# EasyEDA Pro project ProPrj_ST-Link_2025-02-09.epro, board ST-LINK_v1_1
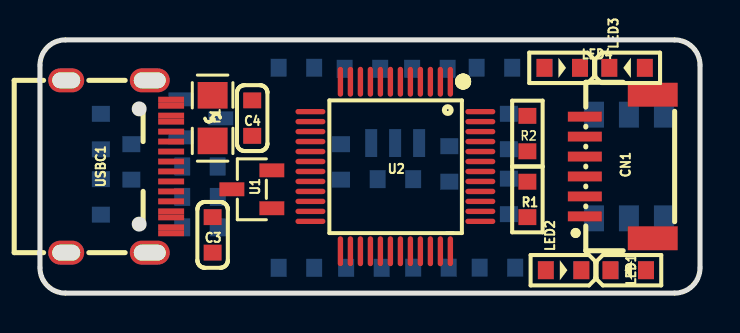
[diagram p7: board, top side]
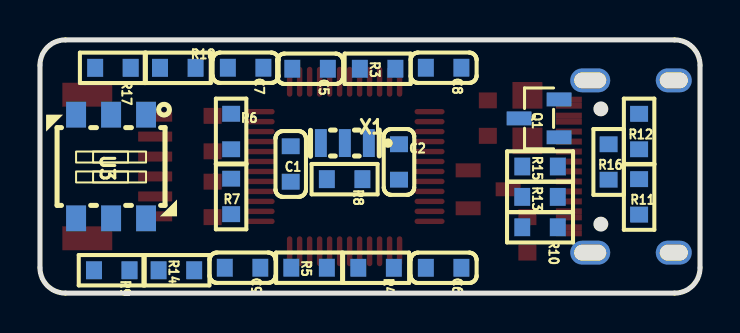
[diagram p8: board, bottom side, seen from below]

Outline 33.02 x 12.7 mm; copper layers: Top Layer, Bottom Layer. Coordinates in mm from the lower left corner of the outline.
Outline path: 0,11.43 0,1.27 arc(0.37,0.37) 1.27,0 31.75,0 arc(32.65,0.37) 33.02,1.27 33.02,11.43 arc(32.65,12.33) 31.75,12.7 1.27,12.7 arc(0.37,12.33) 0,11.43
Stack: Top Layer 0.035mm / Dielectric1 1.51mm FR4 er 4.5 / Bottom Layer 0.035mm

## Design rules (mm)
template: JLCPCB Capability(Two Layers Board)
spacing copperThickness1oz (default): track to track 0.102, other pairs 0.152 to 0.3
spacing copperThickness2oz: track to track 0.203, other pairs 0.152 to 0.3
track width copperThickness1oz (default): min 0.127, default 0.254, max 2.54
track width copperThickness2oz: min 0.203, default 0.254, max 2.54
differential pair differentialPair (default): width min 0.127, default 0.254, max 2.54; gap min 0.152, default 0.152
via viaSize (default): diameter min 0.5, default 0.61, max 10; hole min 0.3, default 0.305, max 6.3

## Placement (name value [footprint] x y rotation side)
C1  22pF  [C0603]  20.48 6.48 90 bottom
C2  22pF  [C0603]  15.06 6.58 90 bottom
C3  10uF  [C0603]  8.64 2.92 90 top
C4  10uF  [C0603]  10.62 8.78 270 top
C5  100nF  [C0603]  19.51 11.25 180 bottom
C6  10uF  [C0603]  12.83 1.27 180 bottom
C7  10uF  [C0603]  22.73 11.3 180 bottom
C8  10uF  [C0603]  12.83 11.3 180 bottom
C9  10uF  [C0603]  22.89 1.27 180 bottom
CN1  WAFER-SH1.0-6PWB  [CONN-SMD_6P-P1.00_XUNPU_WAFER-SH1.0-6PWB]  28.96 6.35 90 top
F1  BSMD0805-100-6V  [F0805]  8.64 8.78 270 top
LED1  LTST-C193TBKT-5A  [LED0603]  29.43 1.15 180 top
LED2  LTST-C193TBKT-5A  [LED0603]  26.2 1.15 0 top
LED3  LTST-C193TBKT-5A  [LED0603]  29.37 11.3 180 top
LED4  LTST-C193TBKT-5A  [LED0603]  26.13 11.3 0 top
Q1  MMBT3904  [SOT-23-3_L2.9-W1.3-P1.90-LS2.4-BR]  8.05 8.76 180 bottom
R1  4.7kΩ  [R0603]  24.38 4.7 270 top
R2  10kΩ  [R0603]  24.38 8 90 top
R3  10kΩ  [R0603]  16.13 11.25 0 bottom
R4  10kΩ  [R0603]  16.21 1.27 0 bottom
R5  10kΩ  [R0603]  19.56 1.27 0 bottom
R6  10kΩ  [R0603]  23.46 8.1 90 bottom
R7  10kΩ  [R0603]  23.46 4.85 270 bottom
R8  100Ω  [R0603]  17.78 5.71 180 bottom
R9  1kΩ  [R0603]  29.43 1.15 180 bottom
R10  10kΩ  [R0603]  8 3.3 180 bottom
R11  22Ω  [R0603]  3.05 4.83 90 bottom
R12  22Ω  [R0603]  3.05 8.1 270 bottom
R13  100Ω  [R0603]  8 4.83 0 bottom
R14  1kΩ  [R0603]  26.2 1.15 0 bottom
R15  36kΩ  [R0603]  8 6.35 0 bottom
R16  1.5kΩ  [R0603]  4.57 6.58 270 bottom
R17  1kΩ  [R0603]  29.37 11.3 180 bottom
R18  1kΩ  [R0603]  26.13 11.3 0 bottom
U1  662K  [SOT-23-3_L2.9-W1.3-P1.90-LS2.4-BR]  10.6 5.21 0 top
U2  STM32F103C8T6  [LQFP-48_L7.0-W7.0-P0.50-LS9.0-BL]  17.78 6.35 180 top
U3  CAS-D20TB1  [SW-SMD_L5.4-W3.9_CAS-D20B]  29.46 6.35 0 bottom
USBC1  TYPE-C-31-M-12  [USB-C_SMD-TYPE-C-31-M-12]  3.94 6.35 270 top
X1  8MHz  [OSC-SMD_3P-L3.2-W1.3-P1.20-L]  17.77 7.53 0 bottom

## Footprints (pads in the part's own frame, mm; a bottom-side part is the same pattern mirrored in y, then rotated)
C0603
  rect 0.8x0.9 smd: 1(-0.889,0) 2(0.889,0)
CONN-SMD_6P-P1.00_XUNPU_WAFER-SH1.0-6PWB
  rect 0.5x1.7 smd: 1(-2.5,1.7) 2(-1.5,1.7) 3(-0.5,1.7) 4(0.5,1.7) 5(1.5,1.7) 6(2.5,1.7)
  rect 1.2x2.5 smd: 7(3.6,-1.7) 8(-3.6,-1.7)
F0805
  rect 1.335x1.5 smd: 1(-1.143,0) 2(1.143,0)
LED0603
  rect 0.8x0.9 smd: 1(-0.889,0) 2(0.888,0)
LQFP-48_L7.0-W7.0-P0.50-LS9.0-BL
  oval 0.27x1.5 smd: 1(-2.75,-4.25) 2(-2.25,-4.25) 3(-1.75,-4.25) 4(-1.25,-4.25) 5(-0.75,-4.25) 6(-0.25,-4.25) 7(0.25,-4.25) 8(0.75,-4.25) 9(1.25,-4.25) 10(1.75,-4.25) 11(2.25,-4.25) 12(2.75,-4.25) 25(2.75,4.25) 26(2.25,4.25) 27(1.75,4.25) 28(1.25,4.25) 29(0.75,4.25) 30(0.25,4.25) 31(-0.25,4.25) 32(-0.75,4.25) 33(-1.25,4.25) 34(-1.75,4.25) 35(-2.25,4.25) 36(-2.75,4.25)
  oval 1.5x0.27 smd: 13(4.25,-2.75) 14(4.25,-2.25) 15(4.25,-1.75) 16(4.25,-1.25) 17(4.25,-0.75) 18(4.25,-0.25) 19(4.25,0.25) 20(4.25,0.75) 21(4.25,1.25) 22(4.25,1.75) 23(4.25,2.25) 24(4.25,2.75) 37(-4.25,2.75) 38(-4.25,2.25) 39(-4.25,1.75) 40(-4.25,1.25) 41(-4.25,0.75) 42(-4.25,0.25) 43(-4.25,-0.25) 44(-4.25,-0.75) 45(-4.25,-1.25) 46(-4.25,-1.75) 47(-4.25,-2.25) 48(-4.25,-2.75)
OSC-SMD_3P-L3.2-W1.3-P1.20-L
  rect 0.6x1.4 smd: 1(-1.199,0) 2(0,0) 3(1.199,0)
R0603
  rect 0.8x0.9 smd: 1(-0.889,0) 2(0.889,0)
SOT-23-3_L2.9-W1.3-P1.90-LS2.4-BR
  rect 1.25x0.7 smd: 1(1,-0.95) 2(1,0.95) 3(-1,0)
SW-SMD_L5.4-W3.9_CAS-D20B
  rect 1x1.3 smd: 1(-1.75,-2.6) 2(0,-2.6) 3(1.75,-2.6) 4(1.75,2.6) 5(0,2.6) 6(-1.75,2.6)
USB-C_SMD-TYPE-C-31-M-12
  oval 1.2x2 hole 0.8x1.6: 1(4.32,1.556) 4(-4.32,1.556)
  oval 1.2x1.8 hole 0.8x1.4: 2(4.32,-2.624) 3(-4.32,-2.624)
  rect 0.3x1.3 smd: A1(-3.35,2.623) A4(-2.55,2.623) A5(-1.25,2.623) A6(-0.25,2.623) A7(0.25,2.623) A8(1.25,2.624) A9(2.55,2.623) A12(3.35,2.623) B1(3.05,2.623) B4(2.25,2.623) B5(1.75,2.623) B6(0.75,2.623) B7(-0.75,2.623) B8(-1.75,2.624) B9(-2.25,2.623) B12(-3.05,2.623)

## Nets
As in the schematic.

Pads without a net: U2 4 11 14 16 17 18 19 21 22 28 29 31 40 41 42 43 45 46; USBC1 A5 A8 B5 B8
